# EAGLE schematic SOC_mcu (EAGLE 6.2)

## Sheet 1 of 5: Alimentación
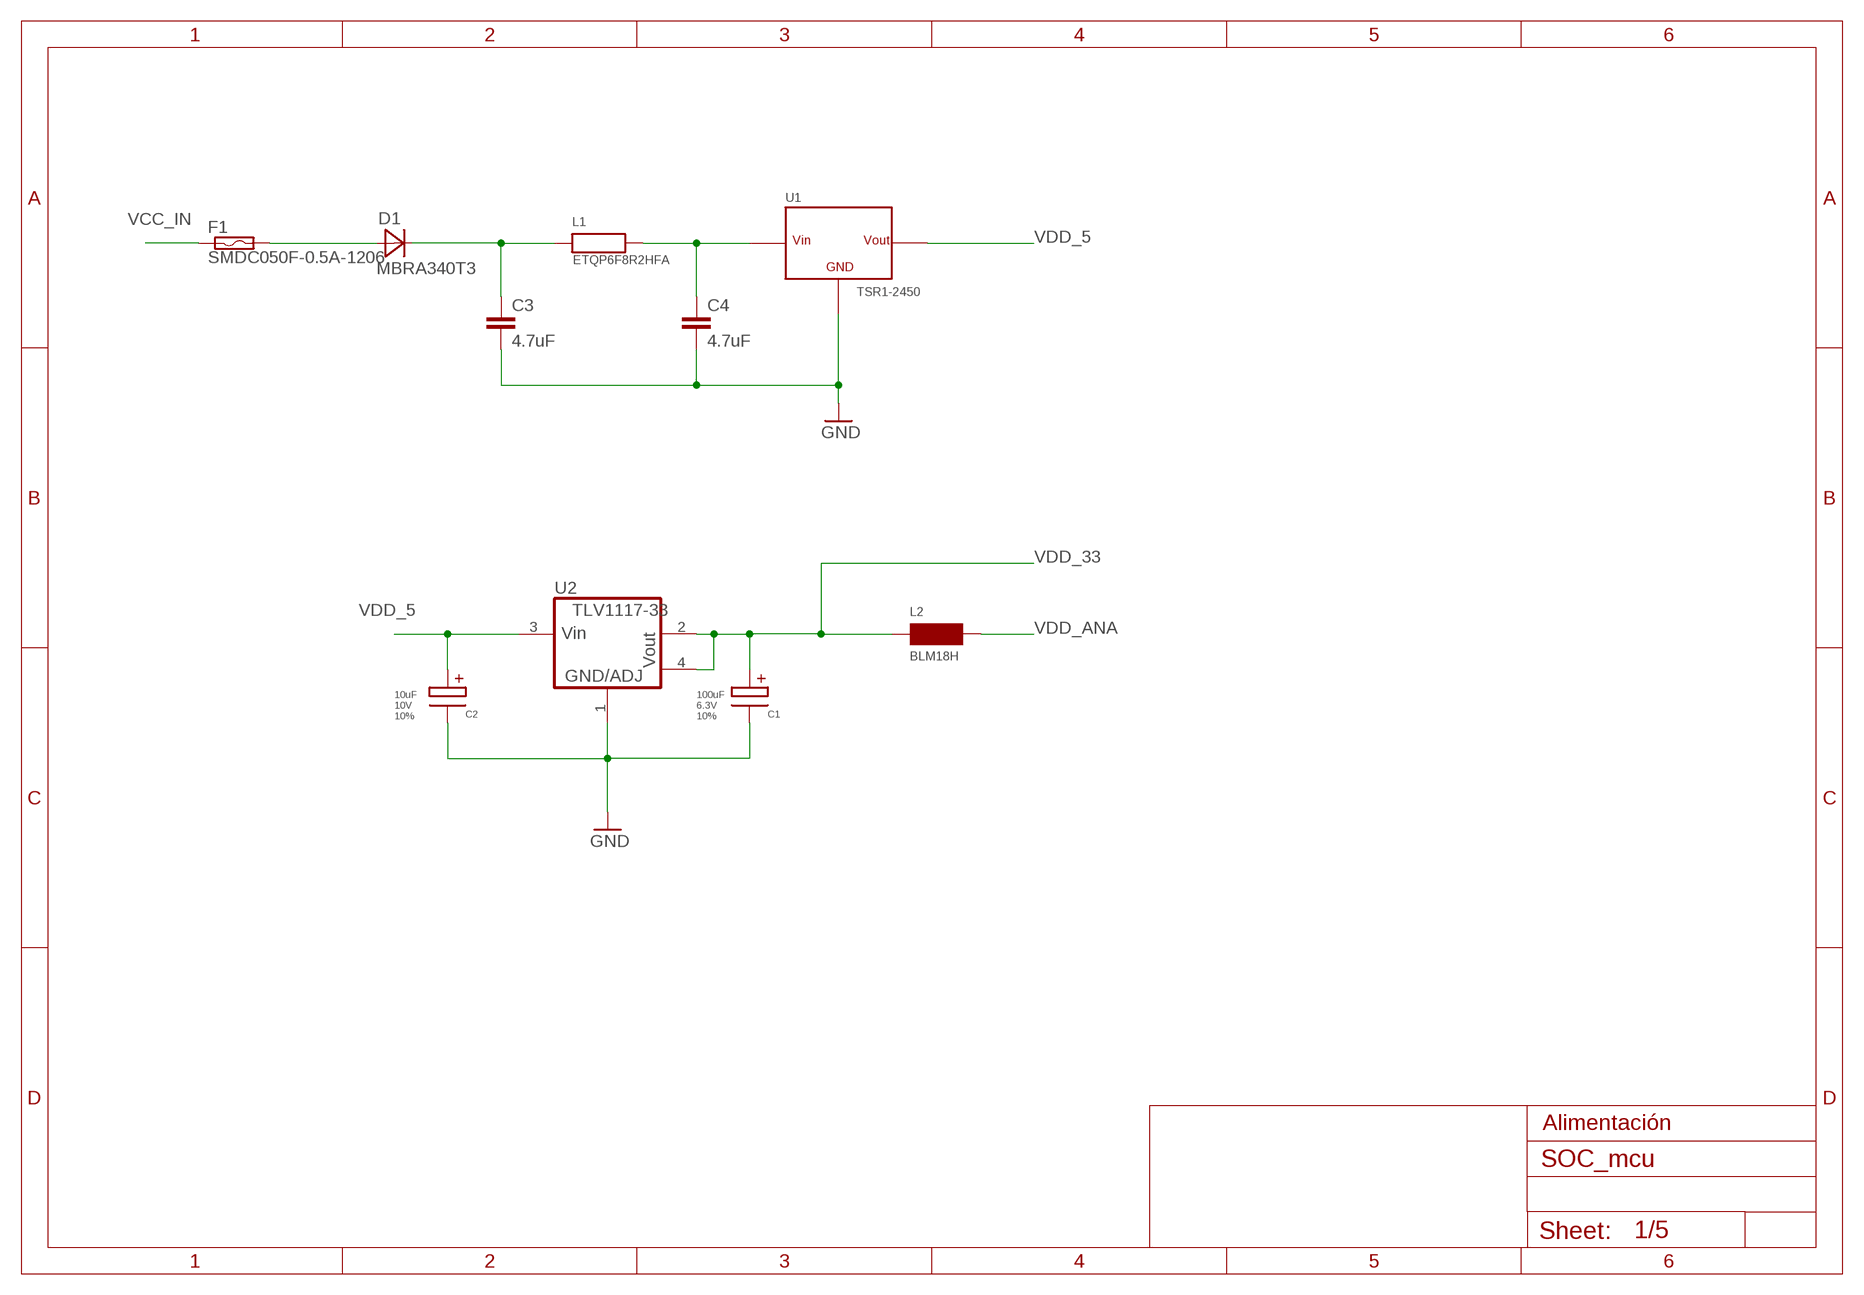
[diagram p0: schematic, sheet 1]

### Parts
C1  100uF  C293D100U-6V3-10%-B  [3528-21]
C2  10uF  C293D10U-10V-10%-B  [3528-21]
C3  4.7uF  C-EUC0805  [C0805]
C4  4.7uF  C-EUC0805  [C0805]
D1  MBRA340T3  [SMA]
F1  SMDC050F-0.5A-1206  [1206]
L1  ETQP6F8R2HFA  [PAN_COIL_CHOKE]
L2  BLM18H  [0603]
U1  TSR1-2450  [TO220V]
U2  TLV1117-33  REG111733  [SOT223]

### Nets
GND: C1.NEG C2.NEG C3.2 C4.2 U1.2(GND) U2.1(GND) ; also sheet 2,3,4
N$1: C4.1 L1.2 U1.1(+VIN)
N$2: C3.1 D1.C L1.1
N$3: D1.A F1.2
VCC_IN: F1.1 ; also sheet 4
VDD_5: C2.POS U1.3(VOUT) U2.3(VIN) ; also sheet 3,4
VDD_33: C1.POS L2.1 U2.2(VOUT) U2.4(VO2) ; also sheet 2,3,4
VDD_ANA: L2.2 ; also sheet 2

### Notes on the sheet
- Alimentación

## Sheet 2 of 5: Microprocesador
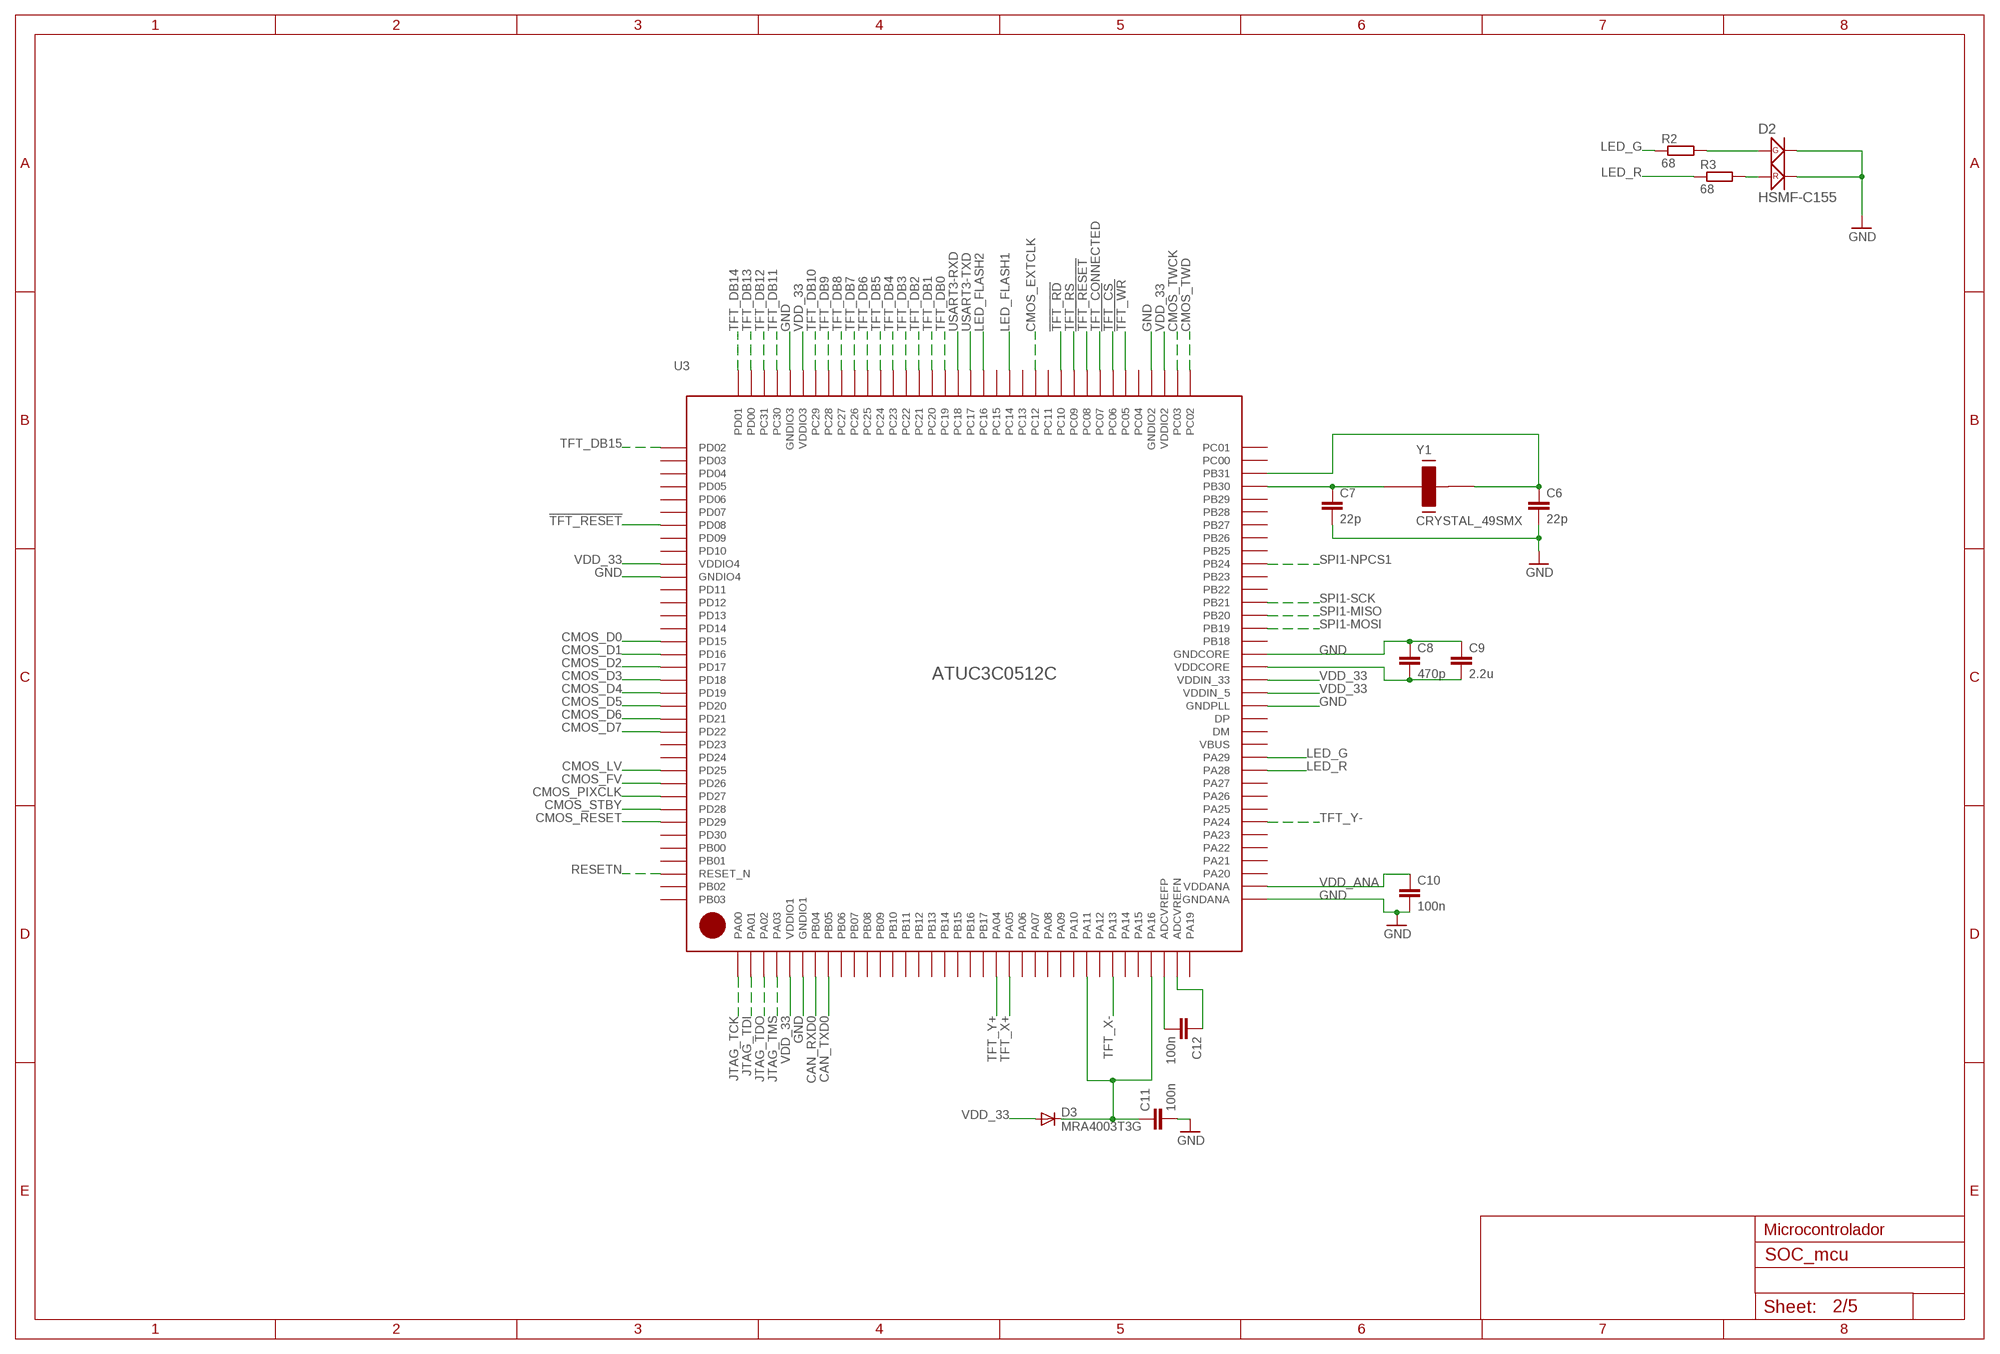
[diagram p1: schematic, sheet 2]

### Parts
C6  22p  C-EUC0603  [C0603]
C7  22p  C-EUC0603  [C0603]
C8  470p  C-EUC0603  [C0603]
C9  2.2u  C-EUC0603  [C0603]
C10  100n  C-EUC0603  [C0603]
C11  100n  C-EUC0603  [C0603]
C12  100n  C-EUC0603  [C0603]
D2  HSMF-C155  [HSMF-C]
D3  MRA4003T3G  DIODE-DO214AC  [DO214AC]
R2  68  R-EU_R0603  [R0603]
R3  68  R-EU_R0603  [R0603]
U3  ATUC3C0512C  [TQFP144]
Y1  CRYSTAL_49SMX  [HC49UP]

### Nets
!TFT_CS: U3.79(PC06) ; also sheet 4
!TFT_RD: U3.83(PC10) ; also sheet 4
!TFT_RESET: U3.81(PC08) U3.115(PD08) ; also sheet 4
!TFT_WR: U3.78(PC05) ; also sheet 4
CAN_RXD0: U3.7(PB04) ; also sheet 3
CAN_TXD0: U3.8(PB05) ; also sheet 3
CMOS_D0: U3.124(PD15) ; also sheet 4
CMOS_D1: U3.125(PD16) ; also sheet 4
CMOS_D2: U3.126(PD17) ; also sheet 4
CMOS_D3: U3.127(PD18) ; also sheet 4
CMOS_D4: U3.128(PD19) ; also sheet 4
CMOS_D5: U3.129(PD20) ; also sheet 4
CMOS_D6: U3.130(PD21) ; also sheet 4
CMOS_D7: U3.131(PD22) ; also sheet 4
CMOS_EXTCLK: U3.85(PC12) ; also sheet 4
CMOS_FV: U3.135(PD26) ; also sheet 4
CMOS_LV: U3.134(PD25) ; also sheet 4
CMOS_PIXCLK: U3.136(PD27) ; also sheet 4
CMOS_RESET: U3.138(PD29) ; also sheet 4
CMOS_STBY: U3.137(PD28) ; also sheet 4
CMOS_TWCK: U3.74(PC03) ; also sheet 4
CMOS_TWD: U3.73(PC02) ; also sheet 4
GND: C6.2 C7.2 C8.1 C9.1 C10.2 C11.2 D2.2 D2.4 U3.6(GNDIO1) U3.37(GNDANA) U3.52(GNDPLL) U3.56(GNDCORE) U3.76(GNDIO2) U3.104(GNDIO3) U3.119(GNDIO4) ; also sheet 1,3,4
JTAG_TCK: U3.1(PA00) ; also sheet 4
JTAG_TDI: U3.2(PA01) ; also sheet 4
JTAG_TDO: U3.3(PA02) ; also sheet 4
JTAG_TMS: U3.4(PA03) ; also sheet 4
LED_FLASH1: U3.87(PC14) ; also sheet 4
LED_FLASH2: U3.89(PC16) ; also sheet 4
LED_G: R2.1 U3.48(PA29)
LED_R: R3.1 U3.47(PA28)
N$4: C6.1 U3.70(PB31) Y1.2
N$5: C7.1 U3.69(PB30) Y1.1
N$6: C8.2 C9.2 U3.55(VDDCORE)
N$7: D2.1 R2.2
N$8: D2.3 R3.2
N$10: C11.1 D3.C U3.28(PA11) U3.33(PA16)
N$11: C12.2 U3.34(ADCVREFP)
N$12: C12.1 U3.35(ADCVREFN)
RESETN: U3.142(RESET_N) ; also sheet 3,4
SPI1-MISO: U3.59(PB20) ; also sheet 3
SPI1-MOSI: U3.58(PB19) ; also sheet 3
SPI1-NPCS1: U3.63(PB24) ; also sheet 3
SPI1-SCK: U3.60(PB21) ; also sheet 3
TFT_CONNECTED: U3.80(PC07) ; also sheet 4
TFT_DB0: U3.92(PC19) ; also sheet 4
TFT_DB1: U3.93(PC20) ; also sheet 4
TFT_DB2: U3.94(PC21) ; also sheet 4
TFT_DB3: U3.95(PC22) ; also sheet 4
TFT_DB4: U3.96(PC23) ; also sheet 4
TFT_DB5: U3.97(PC24) ; also sheet 4
TFT_DB6: U3.98(PC25) ; also sheet 4
TFT_DB7: U3.99(PC26) ; also sheet 4
TFT_DB8: U3.100(PC27) ; also sheet 4
TFT_DB9: U3.101(PC28) ; also sheet 4
TFT_DB10: U3.102(PC29) ; also sheet 4
TFT_DB11: U3.105(PC30) ; also sheet 4
TFT_DB12: U3.106(PC31) ; also sheet 4
TFT_DB13: U3.107(PD00) ; also sheet 4
TFT_DB14: U3.108(PD01) ; also sheet 4
TFT_DB15: U3.109(PD02) ; also sheet 4
TFT_RS: U3.82(PC09) ; also sheet 4
TFT_X+: U3.22(PA05) ; also sheet 4
TFT_X-: U3.30(PA13) ; also sheet 4
TFT_Y+: U3.21(PA04) ; also sheet 4
TFT_Y-: U3.43(PA24) ; also sheet 4
USART3-RXD: U3.91(PC18) ; also sheet 4
USART3-TXD: U3.90(PC17) ; also sheet 4
VDD_33: D3.A U3.5(VDDIO1) U3.53(VDDIN_5) U3.54(VDDIN_33) U3.75(VDDIO2) U3.103(VDDIO3) U3.118(VDDIO4) ; also sheet 1,3,4
VDD_ANA: C10.1 U3.38(VDDANA) ; also sheet 1
Unconnected: U3.9(PB06) U3.10(PB07) U3.11(PB08) U3.12(PB09) U3.13(PB10) U3.14(PB11) U3.15(PB12) U3.16(PB13) U3.17(PB14) U3.18(PB15) U3.19(PB16) U3.20(PB17) U3.23(PA06) U3.24(PA07) U3.25(PA08) U3.26(PA09) U3.27(PA10) U3.29(PA12) U3.31(PA14) U3.32(PA15) U3.36(PA19) U3.39(PA20) U3.40(PA21) U3.41(PA22) U3.42(PA23) U3.44(PA25) U3.45(PA26) U3.46(PA27) U3.49(VBUS) U3.50(DM) U3.51(DP) U3.57(PB18) U3.61(PB22) U3.62(PB23) U3.64(PB25) U3.65(PB26) U3.66(PB27) U3.67(PB28) U3.68(PB29) U3.71(PC00) U3.72(PC01) U3.77(PC04) U3.84(PC11) U3.86(PC13) U3.88(PC15) U3.110(PD03) U3.111(PD04) U3.112(PD05) U3.113(PD06) U3.114(PD07) U3.116(PD09) U3.117(PD10) U3.120(PD11) U3.121(PD12) U3.122(PD13) U3.123(PD14) U3.132(PD23) U3.133(PD24) U3.139(PD30) U3.140(PB00) U3.141(PB01) U3.143(PB02) U3.144(PB03)

### Notes on the sheet
- Microcontrolador

## Sheet 3 of 5: Perifericos
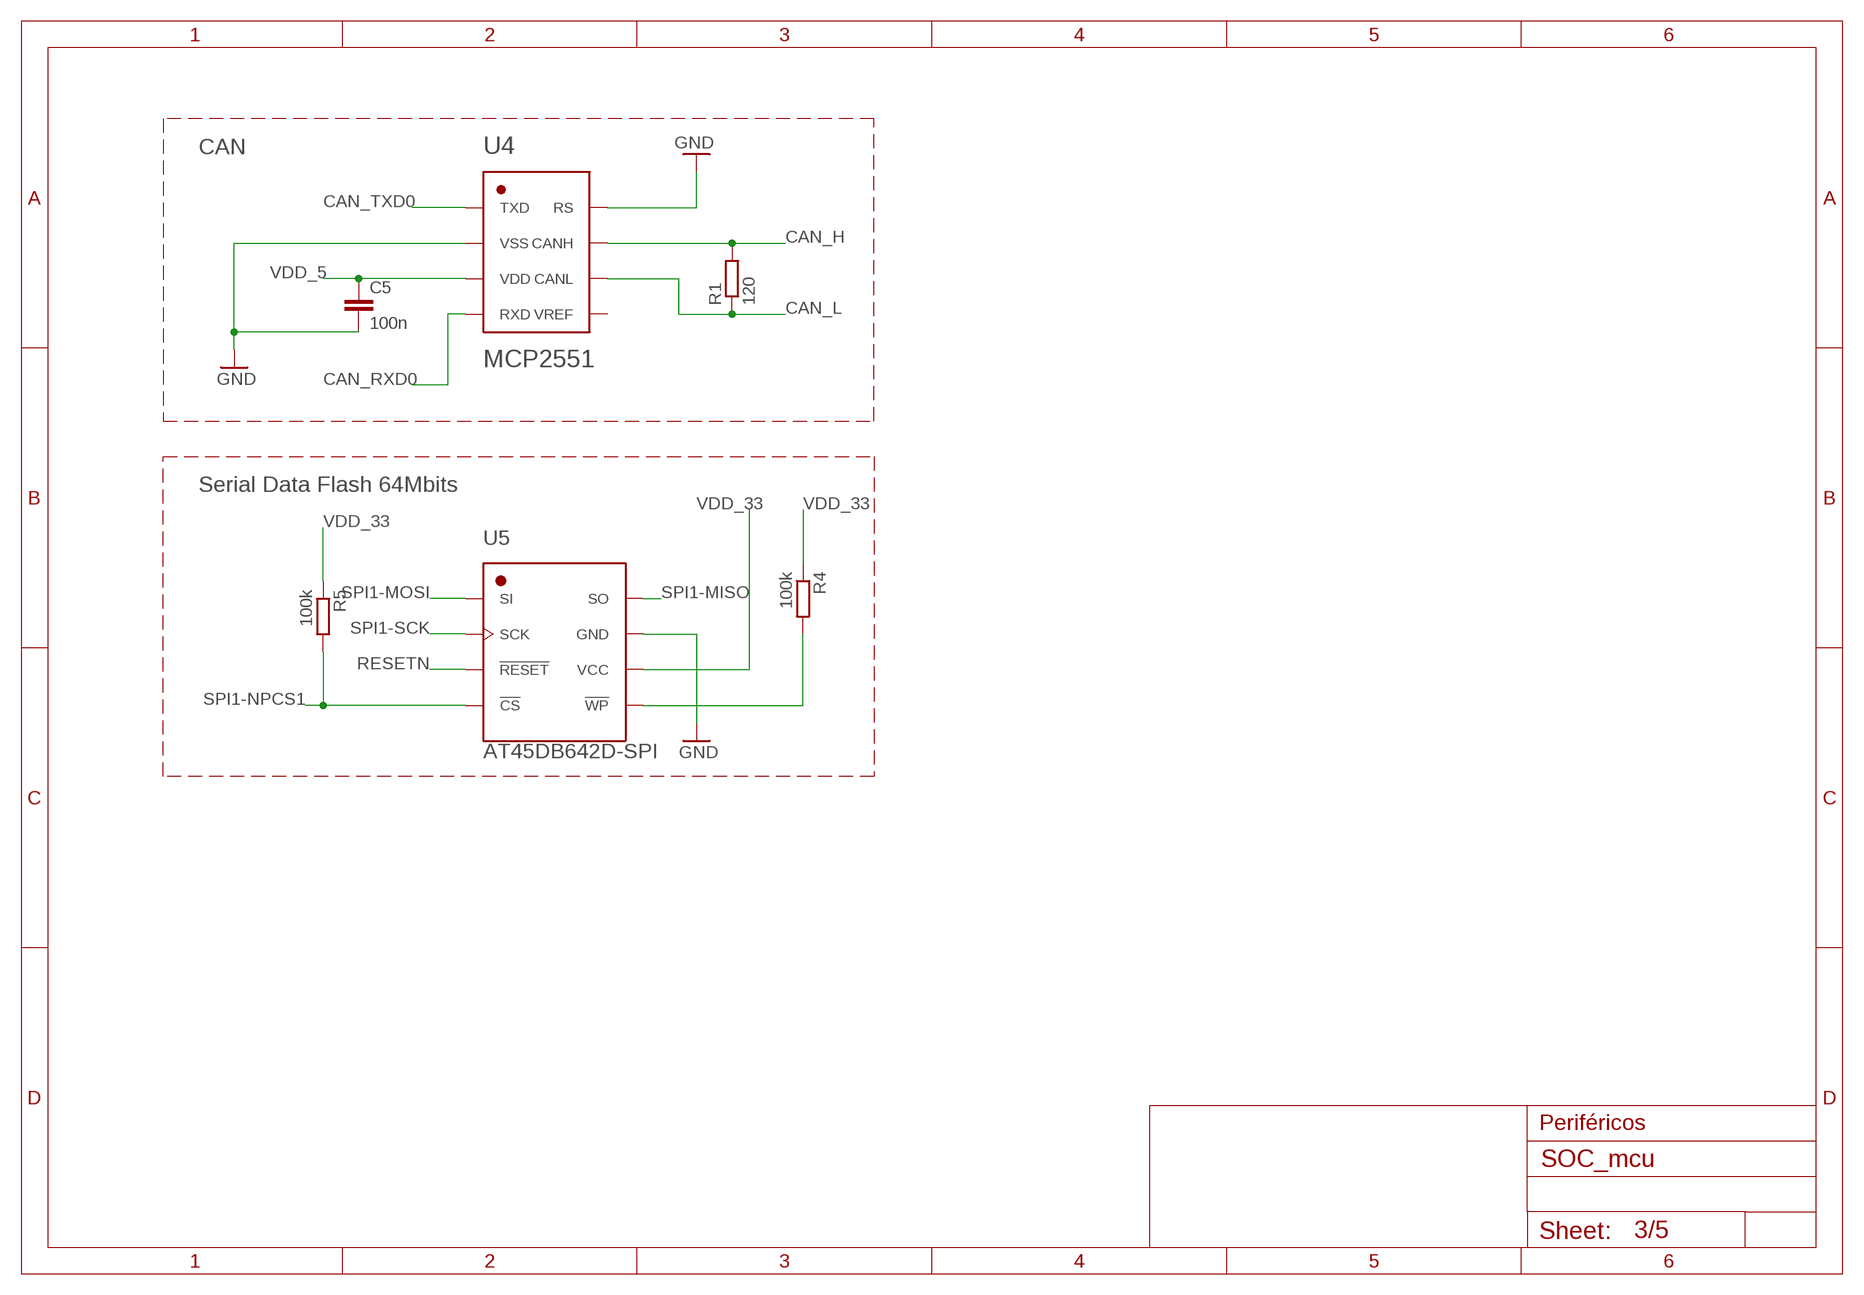
[diagram p2: schematic, sheet 3]

### Parts
C5  100n  C-EUC0603  [C0603]
R1  120  R-EU_R0805  [R0805]
R4  100k  R-EU_R0603  [R0603]
R5  100k  R-EU_R0603  [R0603]
U4  MCP2551  [SO08]
U5  AT45DB642D-SPI  [8CN3]

### Nets
CAN_H: R1.2 U4.7(CANH) ; also sheet 4
CAN_L: R1.1 U4.6(CANL) ; also sheet 4
CAN_RXD0: U4.4(RXD) ; also sheet 2
CAN_TXD0: U4.1(TXD) ; also sheet 2
GND: C5.2 U4.2(VSS) U4.8(RS) U5.7(GND) ; also sheet 1,2,4
N$9: R4.2 U5.5(!WP)
RESETN: U5.3(!RESET) ; also sheet 2,4
SPI1-MISO: U5.8(SO) ; also sheet 2
SPI1-MOSI: U5.1(SI) ; also sheet 2
SPI1-NPCS1: R5.2 U5.4(!CS) ; also sheet 2
SPI1-SCK: U5.2(SCK) ; also sheet 2
VDD_5: C5.1 U4.3(VDD) ; also sheet 1,4
VDD_33: R4.1 R5.1 U5.6(VCC) ; also sheet 1,2,4
Unconnected: U4.5(VREF)

### Notes on the sheet
- CAN
- Serial Data Flash 64Mbits
- Periféricos

## Sheet 4 of 5: Conectores
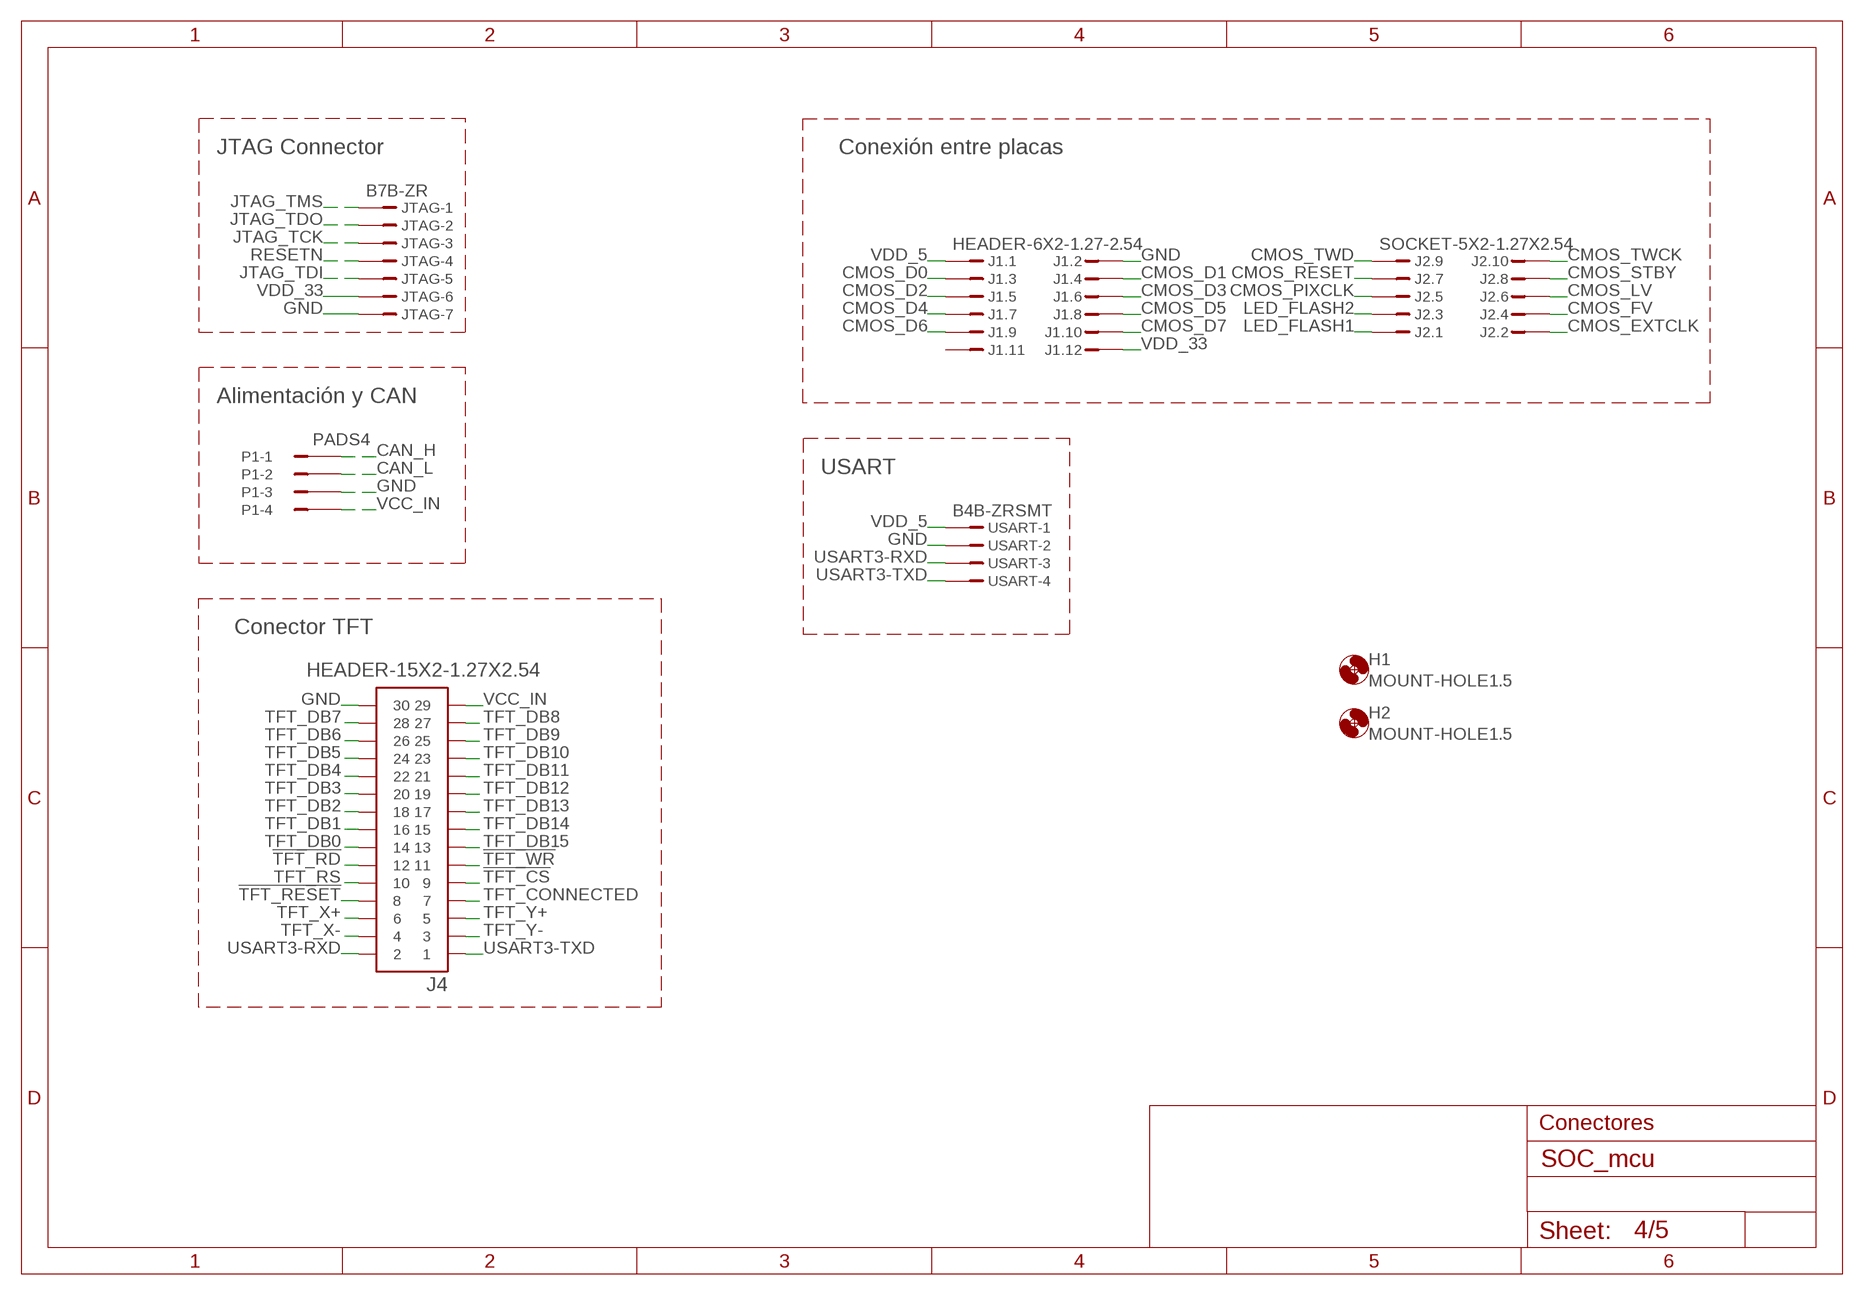
[diagram p3: schematic, sheet 4]

### Parts
H1  MOUNT-HOLE1.5  [1,5]
H2  MOUNT-HOLE1.5  [1,5]
J1  HEADER-6X2-1.27-2.54  [HEADER-THD-6X2(1.27X2.54)]
J2  SOCKET-5X2-1.27X2.54  [SOCKET-THD-5X2(1.27X2.54)]
J4  HEADER-15X2-1.27X2.54  [HEADER-THD-15X2(1.27X2.54)]
JTAG  B7B-ZR  [B7B-ZR]
P1  PADS4  PAD-4  [CAN+POWER]
USART  B4B-ZRSMT  [SM4-TF]

### Nets
!TFT_CS: J4.9 ; also sheet 2
!TFT_RD: J4.12 ; also sheet 2
!TFT_RESET: J4.8 ; also sheet 2
!TFT_WR: J4.11 ; also sheet 2
CAN_H: P1.1 ; also sheet 3
CAN_L: P1.2 ; also sheet 3
CMOS_D0: J1.3 ; also sheet 2
CMOS_D1: J1.4 ; also sheet 2
CMOS_D2: J1.5 ; also sheet 2
CMOS_D3: J1.6 ; also sheet 2
CMOS_D4: J1.7 ; also sheet 2
CMOS_D5: J1.8 ; also sheet 2
CMOS_D6: J1.9 ; also sheet 2
CMOS_D7: J1.10 ; also sheet 2
CMOS_EXTCLK: J2.P2 ; also sheet 2
CMOS_FV: J2.P4 ; also sheet 2
CMOS_LV: J2.P6 ; also sheet 2
CMOS_PIXCLK: J2.P5 ; also sheet 2
CMOS_RESET: J2.P7 ; also sheet 2
CMOS_STBY: J2.P8 ; also sheet 2
CMOS_TWCK: J2.P10 ; also sheet 2
CMOS_TWD: J2.P9 ; also sheet 2
GND: J1.2 J4.30 JTAG.7 P1.3 USART.2 ; also sheet 1,2,3
JTAG_TCK: JTAG.3 ; also sheet 2
JTAG_TDI: JTAG.5 ; also sheet 2
JTAG_TDO: JTAG.2 ; also sheet 2
JTAG_TMS: JTAG.1 ; also sheet 2
LED_FLASH1: J2.P1 ; also sheet 2
LED_FLASH2: J2.P3 ; also sheet 2
RESETN: JTAG.4 ; also sheet 2,3
TFT_CONNECTED: J4.7 ; also sheet 2
TFT_DB0: J4.14 ; also sheet 2
TFT_DB1: J4.16 ; also sheet 2
TFT_DB2: J4.18 ; also sheet 2
TFT_DB3: J4.20 ; also sheet 2
TFT_DB4: J4.22 ; also sheet 2
TFT_DB5: J4.24 ; also sheet 2
TFT_DB6: J4.26 ; also sheet 2
TFT_DB7: J4.28 ; also sheet 2
TFT_DB8: J4.27 ; also sheet 2
TFT_DB9: J4.25 ; also sheet 2
TFT_DB10: J4.23 ; also sheet 2
TFT_DB11: J4.21 ; also sheet 2
TFT_DB12: J4.19 ; also sheet 2
TFT_DB13: J4.17 ; also sheet 2
TFT_DB14: J4.15 ; also sheet 2
TFT_DB15: J4.13 ; also sheet 2
TFT_RS: J4.10 ; also sheet 2
TFT_X+: J4.6 ; also sheet 2
TFT_X-: J4.4 ; also sheet 2
TFT_Y+: J4.5 ; also sheet 2
TFT_Y-: J4.3 ; also sheet 2
USART3-RXD: J4.2 USART.3 ; also sheet 2
USART3-TXD: J4.1 USART.4 ; also sheet 2
VCC_IN: J4.29 P1.4 ; also sheet 1
VDD_5: J1.1 USART.1 ; also sheet 1,3
VDD_33: J1.12 JTAG.6 ; also sheet 1,2,3
Unconnected: J1.11

### Notes on the sheet
- JTAG Connector | Conexión entre placas
- Alimentación y CAN
- USART
- Conector TFT
- Conectores

## Sheet 5 of 5: JTAG conversion board
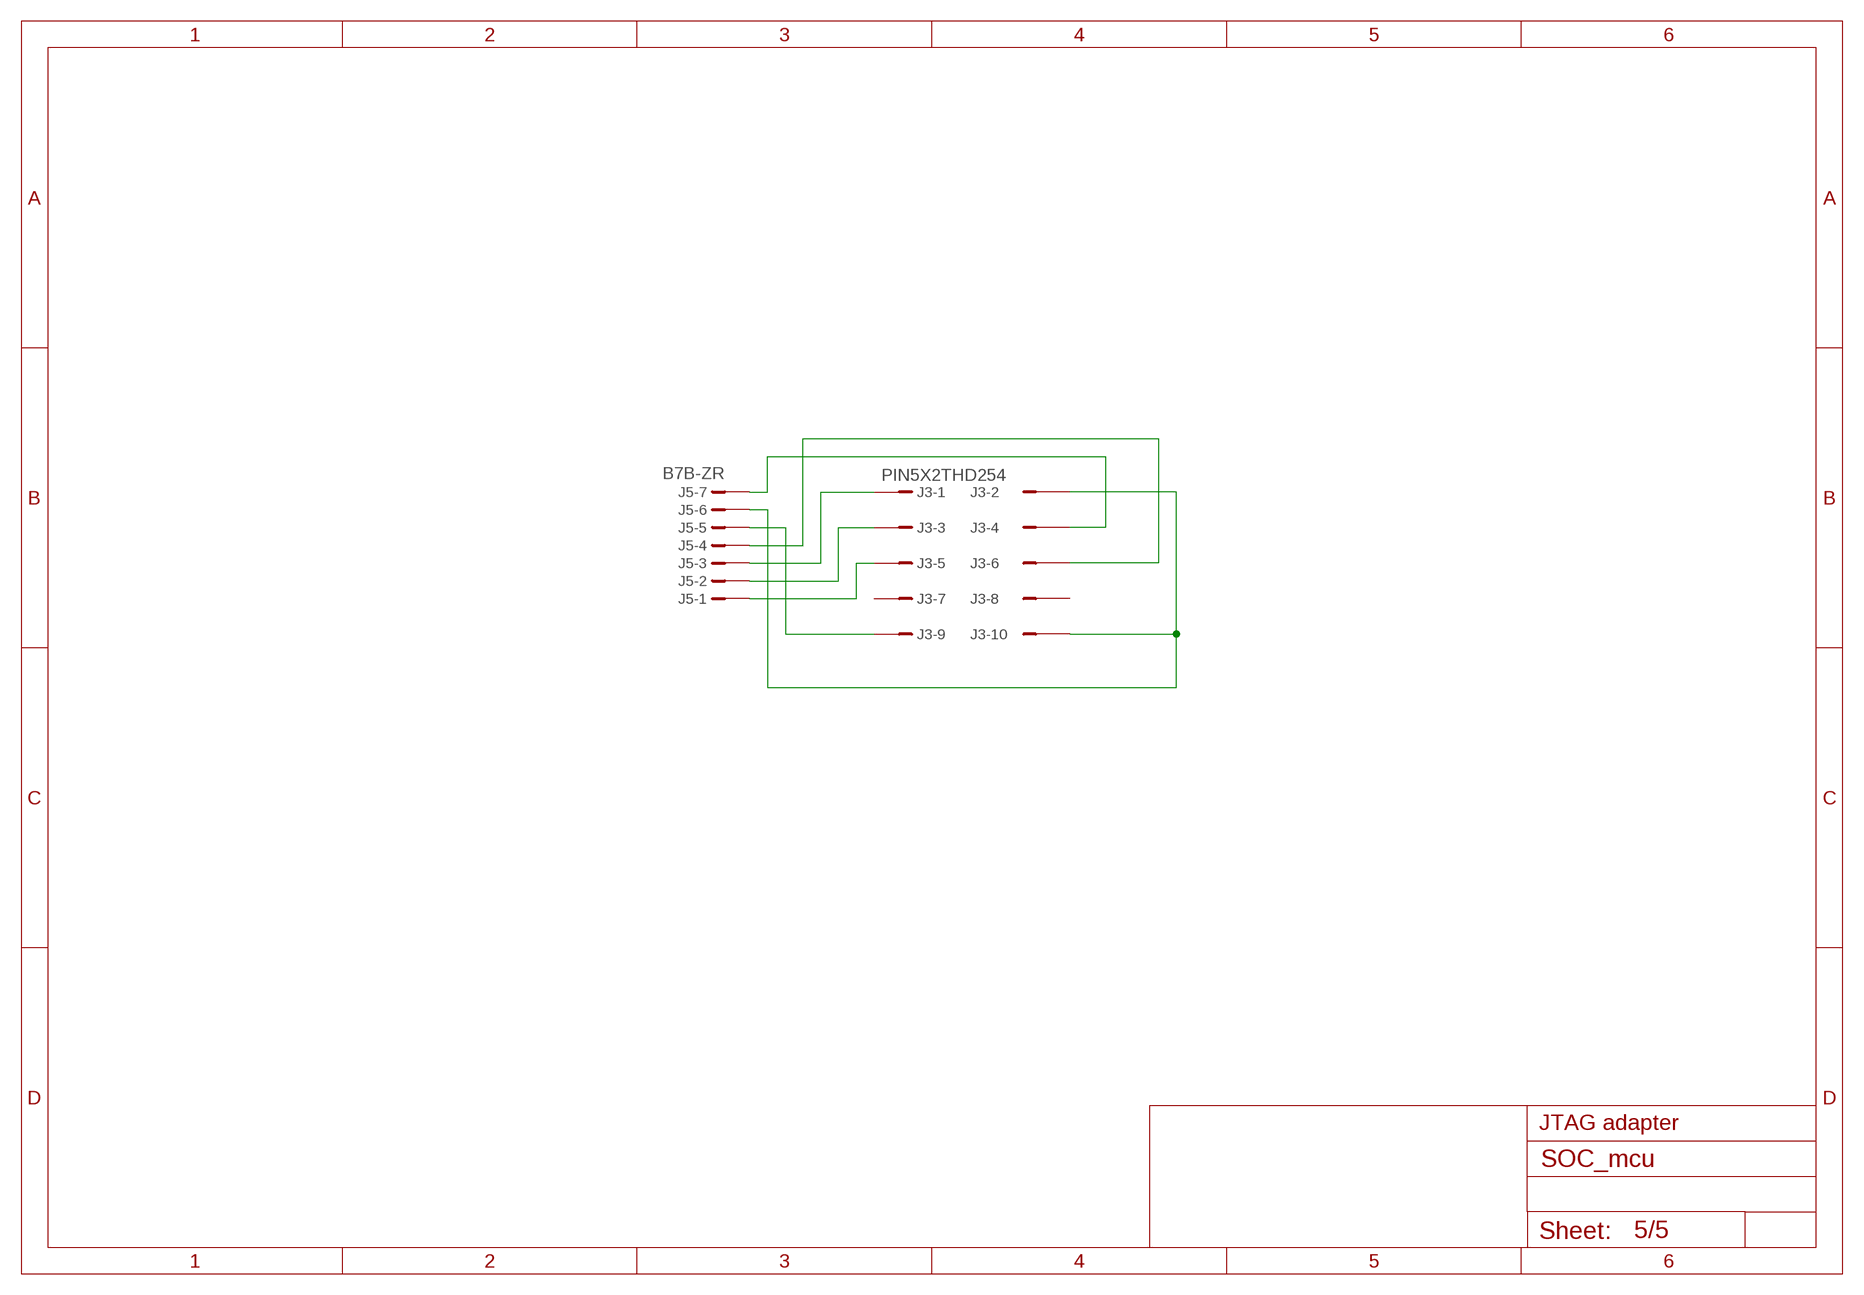
[diagram p4: schematic, sheet 5]

### Parts
J3  PIN5X2THD254  [5X2THD254]
J5  B7B-ZR  [B7B-ZR]

### Nets
N$13: J3.5 J5.1
N$14: J3.3 J5.2
N$15: J3.1 J5.3
N$16: J3.6 J5.4
N$17: J3.9 J5.5
N$18: J3.2 J3.10 J5.6
N$19: J3.4 J5.7
Unconnected: J3.7 J3.8

### Notes on the sheet
- JTAG adapter

## Library data of the parts
C1 = tf_condensador_polarizado:C293D: Condensador; MPN: 293D107X96R3B2TE3; OC_FARNELL: 175-4153; OC_RS: 684-3932; TOLERANCE: 10%; VOLTAGE: 6.3V
C2 = tf_condensador_polarizado:C293D: Condensador; MPN: 293D106X9010B2TE3; OC_FARNELL: 175-4163; OC_RS: 684-3888; TOLERANCE: 10%; VOLTAGE: 10V
C3-C12 = rcl:C-EU: CAPACITOR, European symbol
D1 = diode:MBRA340T3: Surface Mount Schottky Power Rectifier Source: http://www.onsemi.com/pub_link/Collateral/MBRA340T3-D.PDF
D2 = tf_led:HSMF-C155
D3 = diode:DIODE-: DIODE
F1 = tf_fusibles:SMDC050F-*: PolySwitch (TM) Resettable Device Source: Data sheet <http://www.farnell.com/datasheets/68397.pdf>; MPN: NANOSMDC050F/13.2; OC_FARNELL: 134-5942; OC_RS: 138-679
H1 H2 = tf_holes:MOUNT-HOLE: MOUNTING HOLE with drill center marker
J1 = tf_conectores_thd:HEADER-6X2-1.27-2.54: Header 6x2 Header de 2 filas de 6 pines Distáncia entre pines de 1.27mm Distáncia entre filas de 2.54mm
J2 = tf_conectores_thd:SOCKET-5X2-1.27X2.54: Socekt 5x2 Socket de 2 filas de 5 pines Distáncia entre pines de 1.27mm Distáncia entre filas de 2.54mm
J3 = tf_conectores_thd:PIN5X2THD254
J4 = tf_conectores_thd:HEADER-15X2-1.27X2.54
J5 JTAG = tf_conectores_thd:B7B-ZR: ZH CONNECTOR 1.5 mm, 7 pin 1 row Source: http://www.jst.com .. eZH.pdf; MPN: B7B-ZR; OC_FARNELL: 1830903
L1 = tf_bobinas:ETQP6F8R2HFA: Bobina Choke 8.2uH SMD
L2 = tf_ferritas:BLM18H
P1 = tf_conectores_smt:PAD-4: PADS de conexion SMT. 3x3.6mm
R1-R5 = rcl:R-EU_: RESISTOR, European symbol
U1 = tf_conversores_DC_DC:TSR1-*: Regulador familia TSR1. Entrada 6.5 a 34V. Corriente 1A
U2 = tf_conversores_DC_DC:REG1117: 800mA and 1A Low Dropout (LDO) Positive Regulator 1.8V, 2.5V, 2.85V, 3.3V, 5V, and Adj; MPN: TLV1117-CDCY; OC_FARNELL: 1494942; OC_RS: 660-7975
U3 = tf_atmel:ATUC3C0512C: Atmel ATUC3C0512C AVR32 Microcontroller
U4 = tf_comunicaciones:MCP2551: CAN Transciever; MPN: MCP2551; OC_FARNELL: 1467746
U5 = tf_atmel:AT45DB642D-SPI
USART = tf_conectores_thd:B4B-ZR: B4B Connector Connector JST de la serie ZH Datahseet <http://www.farnell.com/datasheets/621906.pdf>
Y1 = tf_xtal:CRYSTAL_49SMX: 16MHz Crystal 49USMX Euroquartz